# Altium schematic sheet 05_信号驱动部分.SchDoc
size A4
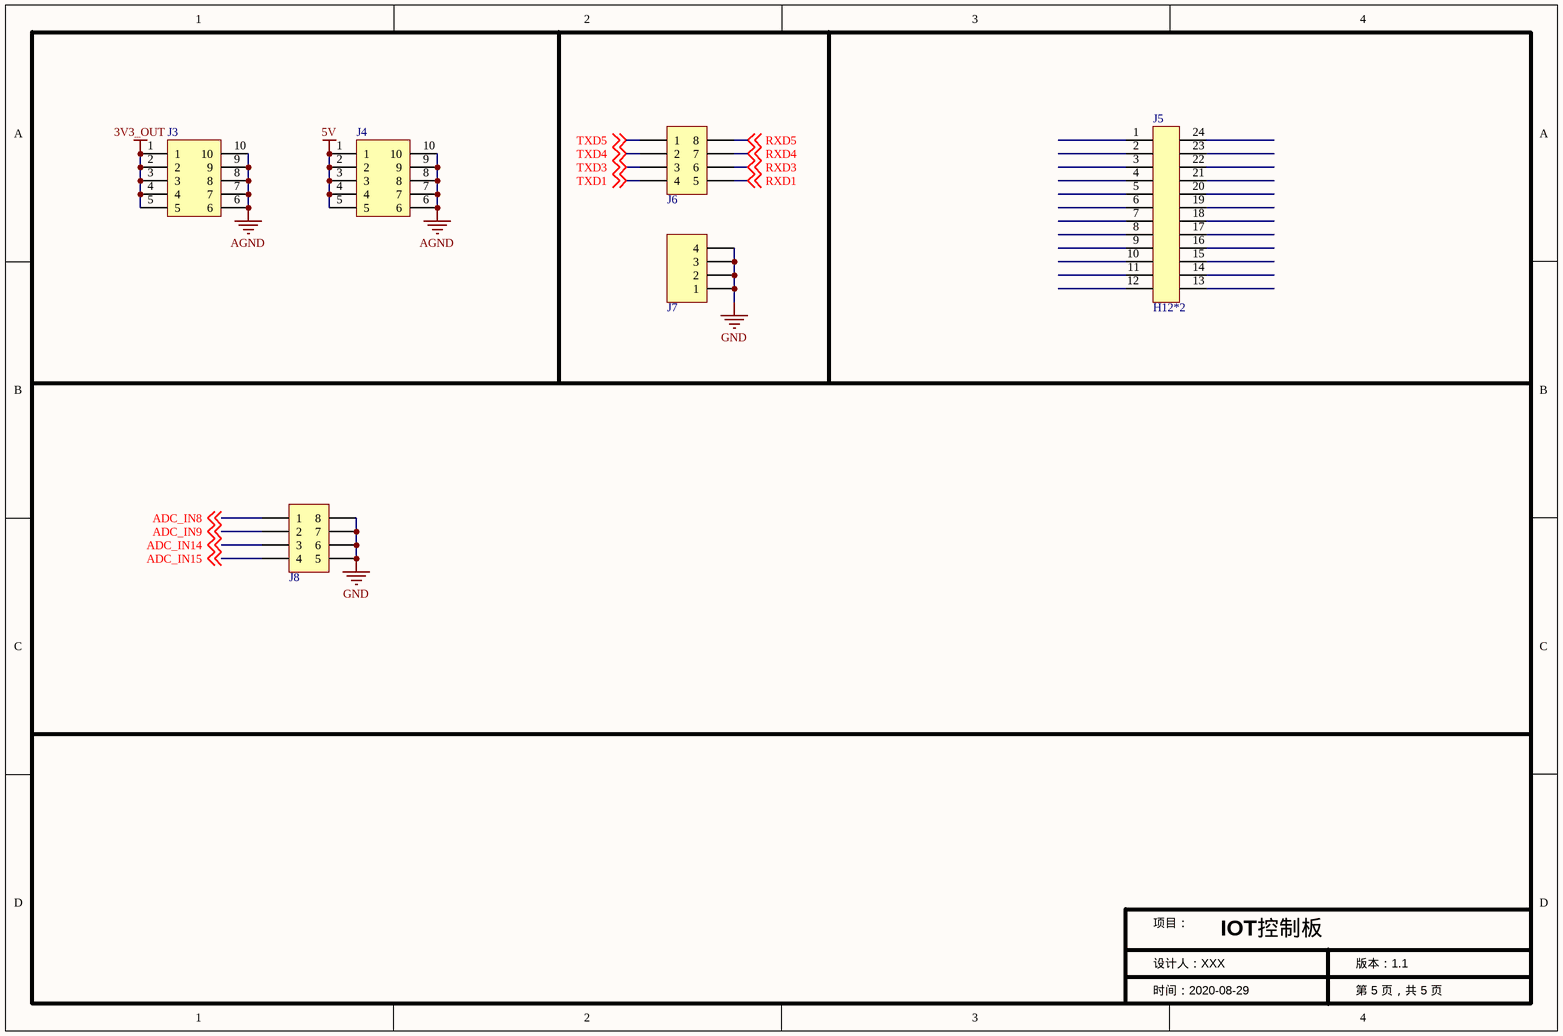
[diagram p0: 05_信号驱动部分.SchDoc]

## Parts
J3  Header_5X2  [Header_5X2_2.54_排针]  (value not drawn)
J4  Header_5X2  [Header_5X2_2.54_排针]  (value not drawn)
J5  H12*2  [H12*2]
J6  Header_4X2  [Header_4x2-2.54]  (value not drawn)
J7  Header 4  [Header_4X1_2.54_排针]  (value not drawn)
J8  Header_4X2  [Header_4x2-2.54]  (value not drawn)

## Nets
3V3_OUT: J3.1 J3.2 J3.3 J3.4 J3.5
5V: J4.1 J4.2 J4.3 J4.4 J4.5
AGND: J3.6 J3.7 J3.8 J3.9 J3.10 J4.6 J4.7 J4.8 J4.9 J4.10
GND: J7.1 J7.2 J7.3 J7.4 J8.5 J8.6 J8.7 J8.8
ADC_IN8: J8.1 ; off-sheet ADC_IN8
ADC_IN9: J8.2 ; off-sheet ADC_IN9
ADC_IN14: J8.3 ; off-sheet ADC_IN14
ADC_IN15: J8.4 ; off-sheet ADC_IN15
RXD1: J6.5 ; off-sheet RXD1
RXD3: J6.6 ; off-sheet RXD3
RXD4: J6.7 ; off-sheet RXD4
RXD5: J6.8 ; off-sheet RXD5
TXD1: J6.4 ; off-sheet TXD1
TXD3: J6.3 ; off-sheet TXD3
TXD4: J6.2 ; off-sheet TXD4
TXD5: J6.1 ; off-sheet TXD5

Not connected (* = marked no-connect by the designer): J5 1 2 3 4 5 6 7 8 9 10 11 12 13 14 15 16 17 18 19 20 21 22 23 24

## Notes on the sheet
- 项目：
- IOT控制板
- 设计人：XXX
- 时间：2020-08-29
- 第 5 页，共 5 页
- 版本：1.1

## Library data of the parts
J3 J4 = Header_5X2: 接插件
J6 J8 = Header_4X2: 接插件; LatestRevisionDate: 17-Jul-2002; LatestRevisionNote: Re-released for DXP Platform.; Publisher: Altium Limited
J7 = Header 4: 接插件; LatestRevisionDate: 17-Jul-2002; LatestRevisionNote: Re-released for DXP Platform.; Publisher: Altium Limited